# Altium project MachDien.PrjPcb
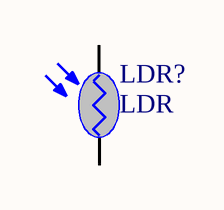
[diagram p0: Sheet1.SchDoc]
1 sheet, 1 parts. Net scope: global (net labels, ports and power ports of the same name join across sheets).
Board file: PCB2.PcbDoc

## Sheet Sheet1.SchDoc
size A4; SheetNumber: 1; SheetTotal: 1

### Parts
LDR?  LDR  [CDS]

### Nets

Not connected (* = marked no-connect by the designer): LDR? 1(A) 2(K)

### Library data of the parts
LDR? = LDR: Quang Tro